# Altium schematic sheet Reed Switches.SchDoc
size A3; SheetNumber: 3; SheetTotal: 5
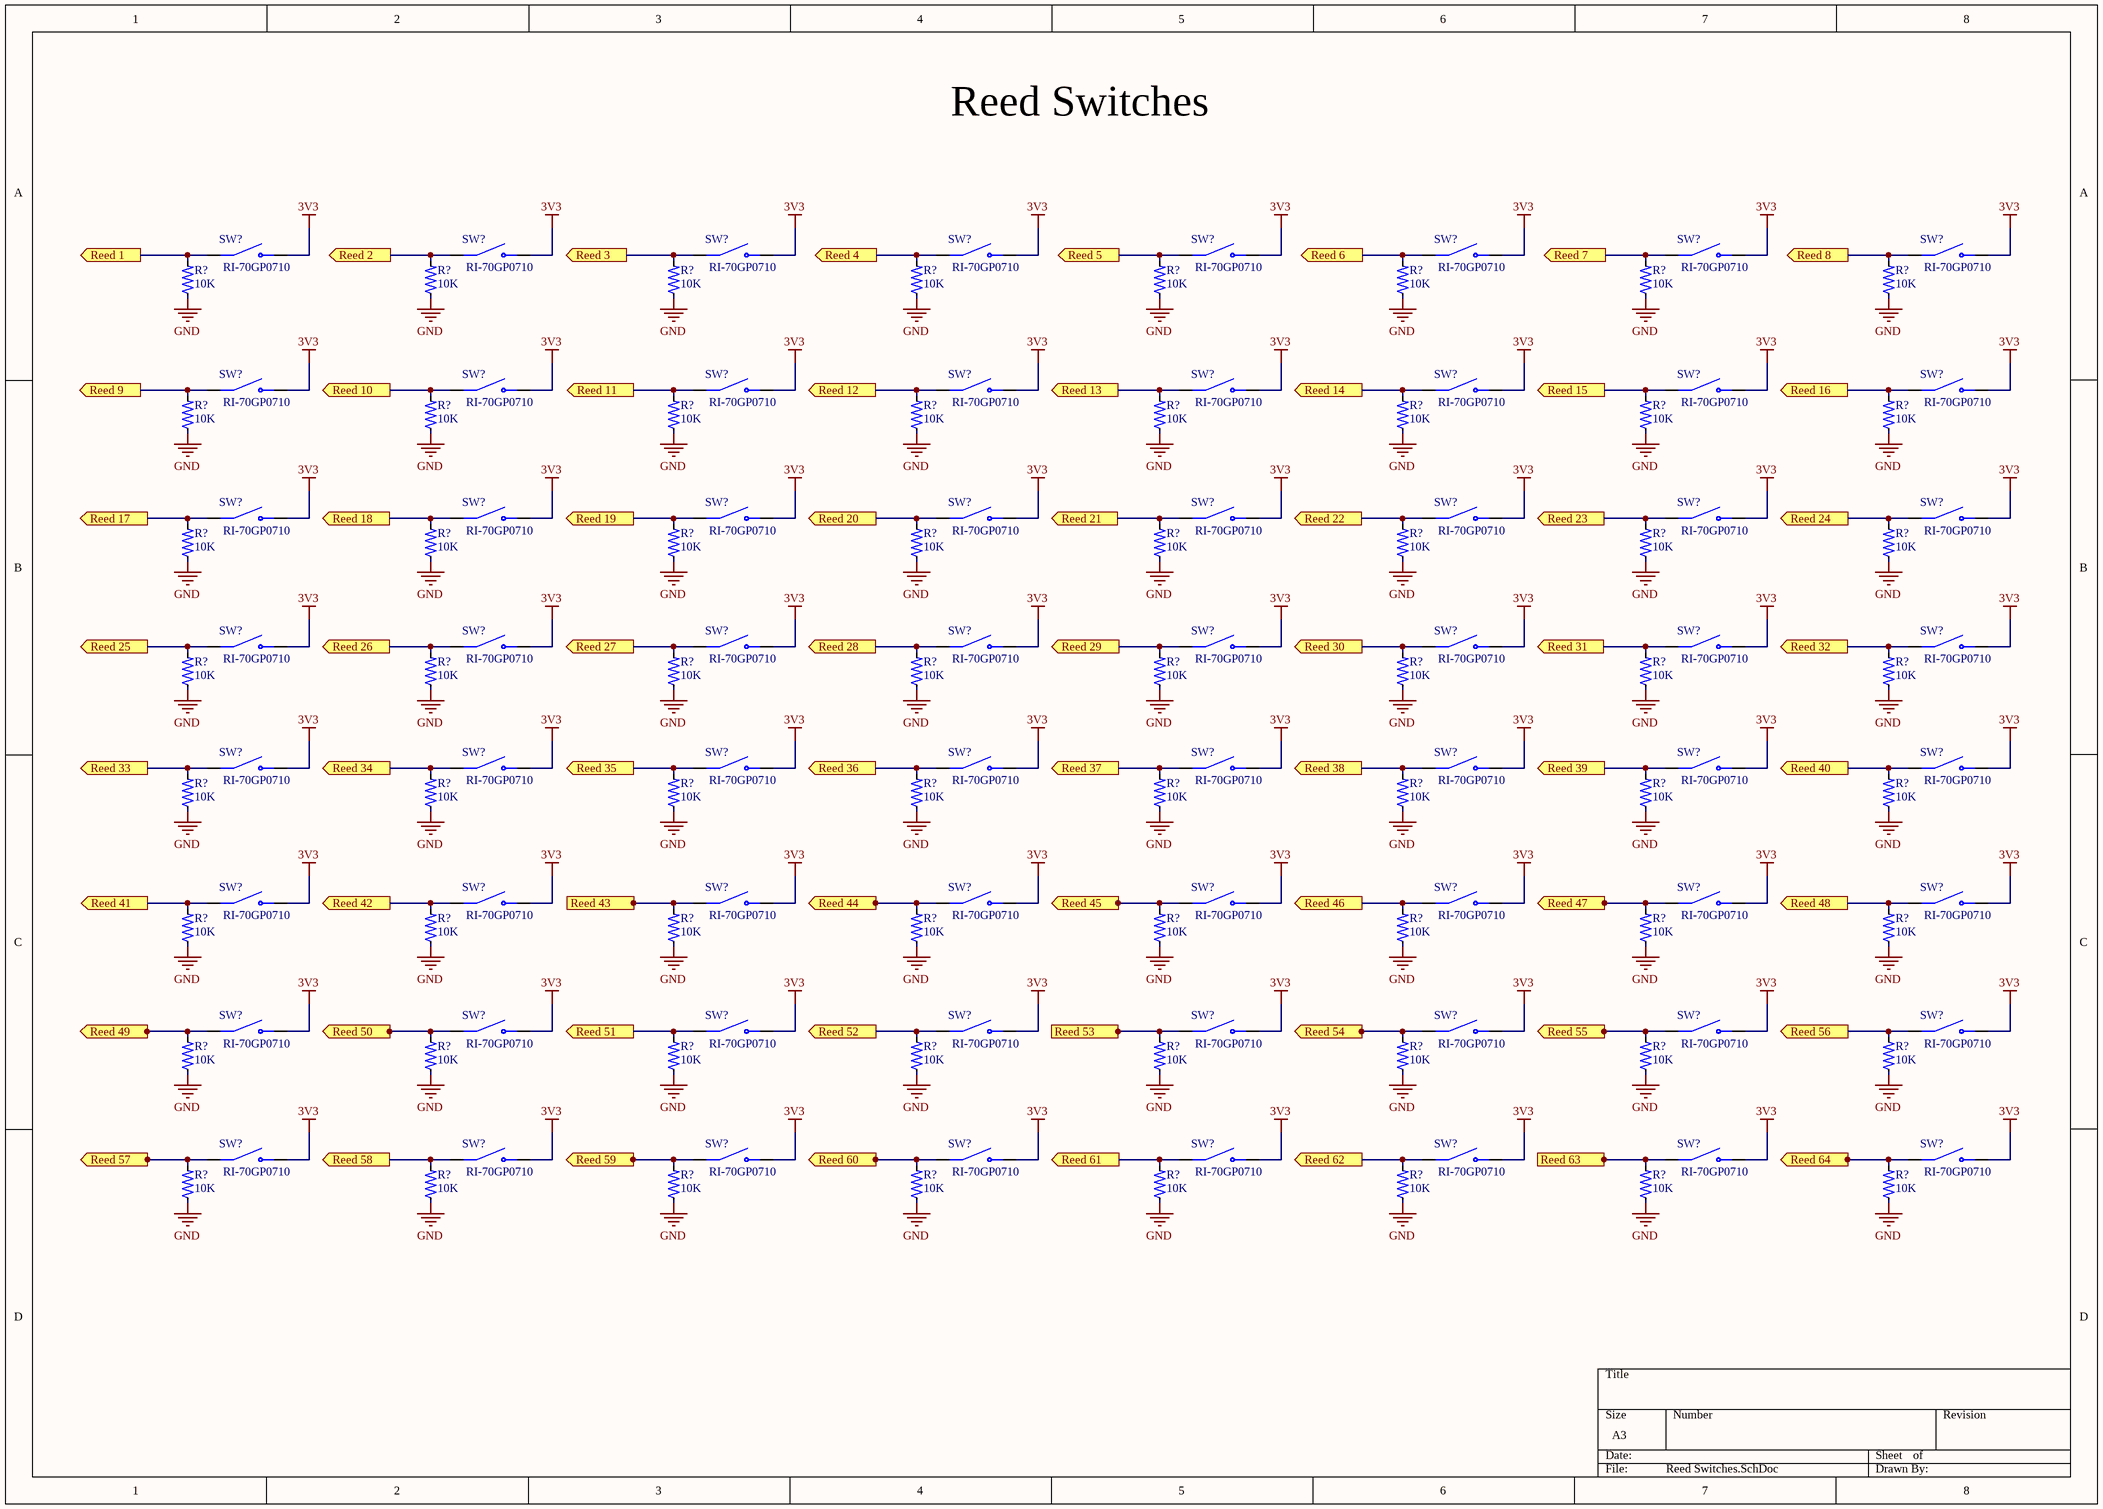
[diagram p0: Reed Switches.SchDoc]

## Parts
(Parts that share a designator on the sheet are numbered #1, #2 ... from top to bottom, then left to right.)
R?#1  10K  [res 0805]
R?#2  10K  [res 0805]
R?#3  10K  [res 0805]
R?#4  10K  [res 0805]
R?#5  10K  [res 0805]
R?#6  10K  [res 0805]
R?#7  10K  [res 0805]
R?#8  10K  [res 0805]
R?#9  10K  [res 0805]
R?#10  10K  [res 0805]
R?#11  10K  [res 0805]
R?#12  10K  [res 0805]
R?#13  10K  [res 0805]
R?#14  10K  [res 0805]
R?#15  10K  [res 0805]
R?#16  10K  [res 0805]
R?#17  10K  [res 0805]
R?#18  10K  [res 0805]
R?#19  10K  [res 0805]
R?#20  10K  [res 0805]
R?#21  10K  [res 0805]
R?#22  10K  [res 0805]
R?#23  10K  [res 0805]
R?#24  10K  [res 0805]
R?#25  10K  [res 0805]
R?#26  10K  [res 0805]
R?#27  10K  [res 0805]
R?#28  10K  [res 0805]
R?#29  10K  [res 0805]
R?#30  10K  [res 0805]
R?#31  10K  [res 0805]
R?#32  10K  [res 0805]
R?#33  10K  [res 0805]
R?#34  10K  [res 0805]
R?#35  10K  [res 0805]
R?#36  10K  [res 0805]
R?#37  10K  [res 0805]
R?#38  10K  [res 0805]
R?#39  10K  [res 0805]
R?#40  10K  [res 0805]
R?#41  10K  [res 0805]
R?#42  10K  [res 0805]
R?#43  10K  [res 0805]
R?#44  10K  [res 0805]
R?#45  10K  [res 0805]
R?#46  10K  [res 0805]
R?#47  10K  [res 0805]
R?#48  10K  [res 0805]
R?#49  10K  [res 0805]
R?#50  10K  [res 0805]
R?#51  10K  [res 0805]
R?#52  10K  [res 0805]
R?#53  10K  [res 0805]
R?#54  10K  [res 0805]
R?#55  10K  [res 0805]
R?#56  10K  [res 0805]
R?#57  10K  [res 0805]
R?#58  10K  [res 0805]
R?#59  10K  [res 0805]
R?#60  10K  [res 0805]
R?#61  10K  [res 0805]
R?#62  10K  [res 0805]
R?#63  10K  [res 0805]
R?#64  10K  [res 0805]
SW?#1  RI-70GP0710
SW?#2  RI-70GP0710
SW?#3  RI-70GP0710
SW?#4  RI-70GP0710
SW?#5  RI-70GP0710
SW?#6  RI-70GP0710
SW?#7  RI-70GP0710
SW?#8  RI-70GP0710
SW?#9  RI-70GP0710
SW?#10  RI-70GP0710
SW?#11  RI-70GP0710
SW?#12  RI-70GP0710
SW?#13  RI-70GP0710
SW?#14  RI-70GP0710
SW?#15  RI-70GP0710
SW?#16  RI-70GP0710
SW?#17  RI-70GP0710
SW?#18  RI-70GP0710
SW?#19  RI-70GP0710
SW?#20  RI-70GP0710
SW?#21  RI-70GP0710
SW?#22  RI-70GP0710
SW?#23  RI-70GP0710
SW?#24  RI-70GP0710
SW?#25  RI-70GP0710
SW?#26  RI-70GP0710
SW?#27  RI-70GP0710
SW?#28  RI-70GP0710
SW?#29  RI-70GP0710
SW?#30  RI-70GP0710
SW?#31  RI-70GP0710
SW?#32  RI-70GP0710
SW?#33  RI-70GP0710
SW?#34  RI-70GP0710
SW?#35  RI-70GP0710
SW?#36  RI-70GP0710
SW?#37  RI-70GP0710
SW?#38  RI-70GP0710
SW?#39  RI-70GP0710
SW?#40  RI-70GP0710
SW?#41  RI-70GP0710
SW?#42  RI-70GP0710
SW?#43  RI-70GP0710
SW?#44  RI-70GP0710
SW?#45  RI-70GP0710
SW?#46  RI-70GP0710
SW?#47  RI-70GP0710
SW?#48  RI-70GP0710
SW?#49  RI-70GP0710
SW?#50  RI-70GP0710
SW?#51  RI-70GP0710
SW?#52  RI-70GP0710
SW?#53  RI-70GP0710
SW?#54  RI-70GP0710
SW?#55  RI-70GP0710
SW?#56  RI-70GP0710
SW?#57  RI-70GP0710
SW?#58  RI-70GP0710
SW?#59  RI-70GP0710
SW?#60  RI-70GP0710
SW?#61  RI-70GP0710
SW?#62  RI-70GP0710
SW?#63  RI-70GP0710
SW?#64  RI-70GP0710

## Ports
Reed 1 (out), Reed 2 (out), Reed 3 (out), Reed 4 (out), Reed 5 (out), Reed 6 (out), Reed 7 (out), Reed 8 (out), Reed 9 (out), Reed 10 (out), Reed 11 (out), Reed 12 (out), Reed 13 (out), Reed 14 (out), Reed 15 (out), Reed 16 (out), Reed 17 (out), Reed 18 (out), Reed 19 (out), Reed 20 (out), Reed 21 (out), Reed 22 (out), Reed 23 (out), Reed 24 (out), Reed 25 (out), Reed 26 (out), Reed 27 (out), Reed 28 (out), Reed 29 (out), Reed 30 (out), Reed 31 (out), Reed 32 (out), Reed 33 (out), Reed 34 (out), Reed 35 (out), Reed 36 (out), Reed 37 (out), Reed 38 (out), Reed 39 (out), Reed 40 (out), Reed 41 (out), Reed 42 (out), Reed 43 (out), Reed 44 (out), Reed 45 (out), Reed 46 (out), Reed 47 (out), Reed 48 (out), Reed 49 (out), Reed 50 (out), Reed 51 (out), Reed 52 (out), Reed 53 (out), Reed 54 (out), Reed 55 (out), Reed 56 (out), Reed 57 (out), Reed 58 (out), Reed 59 (out), Reed 60 (out), Reed 61 (out), Reed 62 (out), Reed 63 (out), Reed 64 (out)

## Nets
3V3: SW?#1.2(NO) SW?#2.2(NO) SW?#3.2(NO) SW?#4.2(NO) SW?#5.2(NO) SW?#6.2(NO) SW?#7.2(NO) SW?#8.2(NO) SW?#9.2(NO) SW?#10.2(NO) SW?#11.2(NO) SW?#12.2(NO) SW?#13.2(NO) SW?#14.2(NO) SW?#15.2(NO) SW?#16.2(NO) SW?#17.2(NO) SW?#18.2(NO) SW?#19.2(NO) SW?#20.2(NO) SW?#21.2(NO) SW?#22.2(NO) SW?#23.2(NO) SW?#24.2(NO) SW?#25.2(NO) SW?#26.2(NO) SW?#27.2(NO) SW?#28.2(NO) SW?#29.2(NO) SW?#30.2(NO) SW?#31.2(NO) SW?#32.2(NO) SW?#33.2(NO) SW?#34.2(NO) SW?#35.2(NO) SW?#36.2(NO) SW?#37.2(NO) SW?#38.2(NO) SW?#39.2(NO) SW?#40.2(NO) SW?#41.2(NO) SW?#42.2(NO) SW?#43.2(NO) SW?#44.2(NO) SW?#45.2(NO) SW?#46.2(NO) SW?#47.2(NO) SW?#48.2(NO) SW?#49.2(NO) SW?#50.2(NO) SW?#51.2(NO) SW?#52.2(NO) SW?#53.2(NO) SW?#54.2(NO) SW?#55.2(NO) SW?#56.2(NO) SW?#57.2(NO) SW?#58.2(NO) SW?#59.2(NO) SW?#60.2(NO) SW?#61.2(NO) SW?#62.2(NO) SW?#63.2(NO) SW?#64.2(NO)
GND: R?#1.1 R?#2.1 R?#3.1 R?#4.1 R?#5.1 R?#6.1 R?#7.1 R?#8.1 R?#9.1 R?#10.1 R?#11.1 R?#12.1 R?#13.1 R?#14.1 R?#15.1 R?#16.1 R?#17.1 R?#18.1 R?#19.1 R?#20.1 R?#21.1 R?#22.1 R?#23.1 R?#24.1 R?#25.1 R?#26.1 R?#27.1 R?#28.1 R?#29.1 R?#30.1 R?#31.1 R?#32.1 R?#33.1 R?#34.1 R?#35.1 R?#36.1 R?#37.1 R?#38.1 R?#39.1 R?#40.1 R?#41.1 R?#42.1 R?#43.1 R?#44.1 R?#45.1 R?#46.1 R?#47.1 R?#48.1 R?#49.1 R?#50.1 R?#51.1 R?#52.1 R?#53.1 R?#54.1 R?#55.1 R?#56.1 R?#57.1 R?#58.1 R?#59.1 R?#60.1 R?#61.1 R?#62.1 R?#63.1 R?#64.1
Reed 1: R?#1.2 SW?#1.1(COM) ; port Reed 1
Reed 2: R?#2.2 SW?#2.1(COM) ; port Reed 2
Reed 3: R?#3.2 SW?#3.1(COM) ; port Reed 3
Reed 4: R?#4.2 SW?#4.1(COM) ; port Reed 4
Reed 5: R?#5.2 SW?#5.1(COM) ; port Reed 5
Reed 6: R?#6.2 SW?#6.1(COM) ; port Reed 6
Reed 7: R?#7.2 SW?#7.1(COM) ; port Reed 7
Reed 8: R?#8.2 SW?#8.1(COM) ; port Reed 8
Reed 9: R?#9.2 SW?#9.1(COM) ; port Reed 9
Reed 10: R?#10.2 SW?#10.1(COM) ; port Reed 10
Reed 11: R?#11.2 SW?#11.1(COM) ; port Reed 11
Reed 12: R?#12.2 SW?#12.1(COM) ; port Reed 12
Reed 13: R?#13.2 SW?#13.1(COM) ; port Reed 13
Reed 14: R?#14.2 SW?#14.1(COM) ; port Reed 14
Reed 15: R?#15.2 SW?#15.1(COM) ; port Reed 15
Reed 16: R?#16.2 SW?#16.1(COM) ; port Reed 16
Reed 17: R?#17.2 SW?#17.1(COM) ; port Reed 17
Reed 18: R?#18.2 SW?#18.1(COM) ; port Reed 18
Reed 19: R?#19.2 SW?#19.1(COM) ; port Reed 19
Reed 20: R?#20.2 SW?#20.1(COM) ; port Reed 20
Reed 21: R?#21.2 SW?#21.1(COM) ; port Reed 21
Reed 22: R?#22.2 SW?#22.1(COM) ; port Reed 22
Reed 23: R?#23.2 SW?#23.1(COM) ; port Reed 23
Reed 24: R?#24.2 SW?#24.1(COM) ; port Reed 24
Reed 25: R?#25.2 SW?#25.1(COM) ; port Reed 25
Reed 26: R?#26.2 SW?#26.1(COM) ; port Reed 26
Reed 27: R?#27.2 SW?#27.1(COM) ; port Reed 27
Reed 28: R?#28.2 SW?#28.1(COM) ; port Reed 28
Reed 29: R?#29.2 SW?#29.1(COM) ; port Reed 29
Reed 30: R?#30.2 SW?#30.1(COM) ; port Reed 30
Reed 31: R?#31.2 SW?#31.1(COM) ; port Reed 31
Reed 32: R?#32.2 SW?#32.1(COM) ; port Reed 32
Reed 33: R?#33.2 SW?#33.1(COM) ; port Reed 33
Reed 34: R?#34.2 SW?#34.1(COM) ; port Reed 34
Reed 35: R?#35.2 SW?#35.1(COM) ; port Reed 35
Reed 36: R?#36.2 SW?#36.1(COM) ; port Reed 36
Reed 37: R?#37.2 SW?#37.1(COM) ; port Reed 37
Reed 38: R?#38.2 SW?#38.1(COM) ; port Reed 38
Reed 39: R?#39.2 SW?#39.1(COM) ; port Reed 39
Reed 40: R?#40.2 SW?#40.1(COM) ; port Reed 40
Reed 41: R?#41.2 SW?#41.1(COM) ; port Reed 41
Reed 42: R?#42.2 SW?#42.1(COM) ; port Reed 42
Reed 43: R?#43.2 SW?#43.1(COM) ; port Reed 43
Reed 44: R?#44.2 SW?#44.1(COM) ; port Reed 44
Reed 45: R?#45.2 SW?#45.1(COM) ; port Reed 45
Reed 46: R?#46.2 SW?#46.1(COM) ; port Reed 46
Reed 47: R?#47.2 SW?#47.1(COM) ; port Reed 47
Reed 48: R?#48.2 SW?#48.1(COM) ; port Reed 48
Reed 49: R?#49.2 SW?#49.1(COM) ; port Reed 49
Reed 50: R?#50.2 SW?#50.1(COM) ; port Reed 50
Reed 51: R?#51.2 SW?#51.1(COM) ; port Reed 51
Reed 52: R?#52.2 SW?#52.1(COM) ; port Reed 52
Reed 53: R?#53.2 SW?#53.1(COM) ; port Reed 53
Reed 54: R?#54.2 SW?#54.1(COM) ; port Reed 54
Reed 55: R?#55.2 SW?#55.1(COM) ; port Reed 55
Reed 56: R?#56.2 SW?#56.1(COM) ; port Reed 56
Reed 57: R?#57.2 SW?#57.1(COM) ; port Reed 57
Reed 58: R?#58.2 SW?#58.1(COM) ; port Reed 58
Reed 59: R?#59.2 SW?#59.1(COM) ; port Reed 59
Reed 60: R?#60.2 SW?#60.1(COM) ; port Reed 60
Reed 61: R?#61.2 SW?#61.1(COM) ; port Reed 61
Reed 62: R?#62.2 SW?#62.1(COM) ; port Reed 62
Reed 63: R?#63.2 SW?#63.1(COM) ; port Reed 63
Reed 64: R?#64.2 SW?#64.1(COM) ; port Reed 64

## Notes on the sheet
- Reed Switches

## Library data of the parts
R?#1-R?#64 = Resistor 0805: MP: 2-2176053-2; Resistance: .39; Power_Rating: .25 W; MF: TE Connectivity; Tolerance: 1%; Package: 0805; Value: *; SnapEDA_Link: https://www.snapeda.com/parts/2-2176053-2/TE%20Connectivity/view-part/2214511/?ref=snap; Availability: Unavailable; Price: None; EU_RoHS_Compliance: Compliant with Exemptions
SW?#1-SW?#64 = RI-70GP0710: Switch Reed Spst-no 500MA 120V; Manufacturer: Comus; Supplier: Digikey; Supplier Part Number: 1835-1025-ND; Manufacturer Part Number: RI-70GP0710; RoHS: No; Stock: 52347; Pricing: 1=1.05, 10=1.01, 25=0.9496, 100=0.8201, 250=0.7474, 500=0.69488, 2000=0.6464, 4000=0.5858, 6000=0.5454 (USD); ComponentLink1URL: https://www.comus-intl.com/wp-content/uploads/2018/10/RI-70GP.pdf?src-supplier=Digikey; ComponentLink1Description: https://www.comus-intl.com/wp-content/uploads/2018/10/RI-70GP.pdf?src-supplier=Digikey